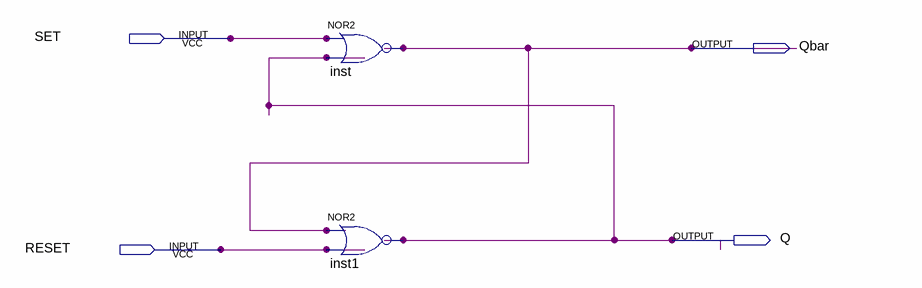
[diagram p0: schematic sheet]
// Quartus schematic Latch1.bdf as structural Verilog: 2 symbols, 4 pins
module Latch1 (
  input  SET,
  input  RESET,
  output Qbar,
  output Q
);

  nor inst (Qbar, SET, Q);
  nor inst1 (Q, Qbar, RESET);
endmodule
